# Altium schematic sheet Kasli-SOC_top.SchDoc: KASLI SOC v1.2.0
size 420 x 297 mm; Projet: FPGA & ARM SoC FMC Carrier; CheckedBy: G.Kasprowicz; Author: F.Switakowski; CompanyName: WUT ISE; DrawnBy: F.Switakowski; Organization: WUT ISE; Address1: PW ISE; Address2: Nowowiejska 15/19 00-665 Warsaw; Address3: gkasprow@gmail.com; DocumentNumber: 1; Revision: 1; SheetNumber: 1; SheetTotal: 18; ModifiedBy: -; CheckedDate: -; Title2: Top; DivGrp: WUT ISE; Designer: G.Kasprowicz; ModifiedDate: -; ProjectName: Sensor Box
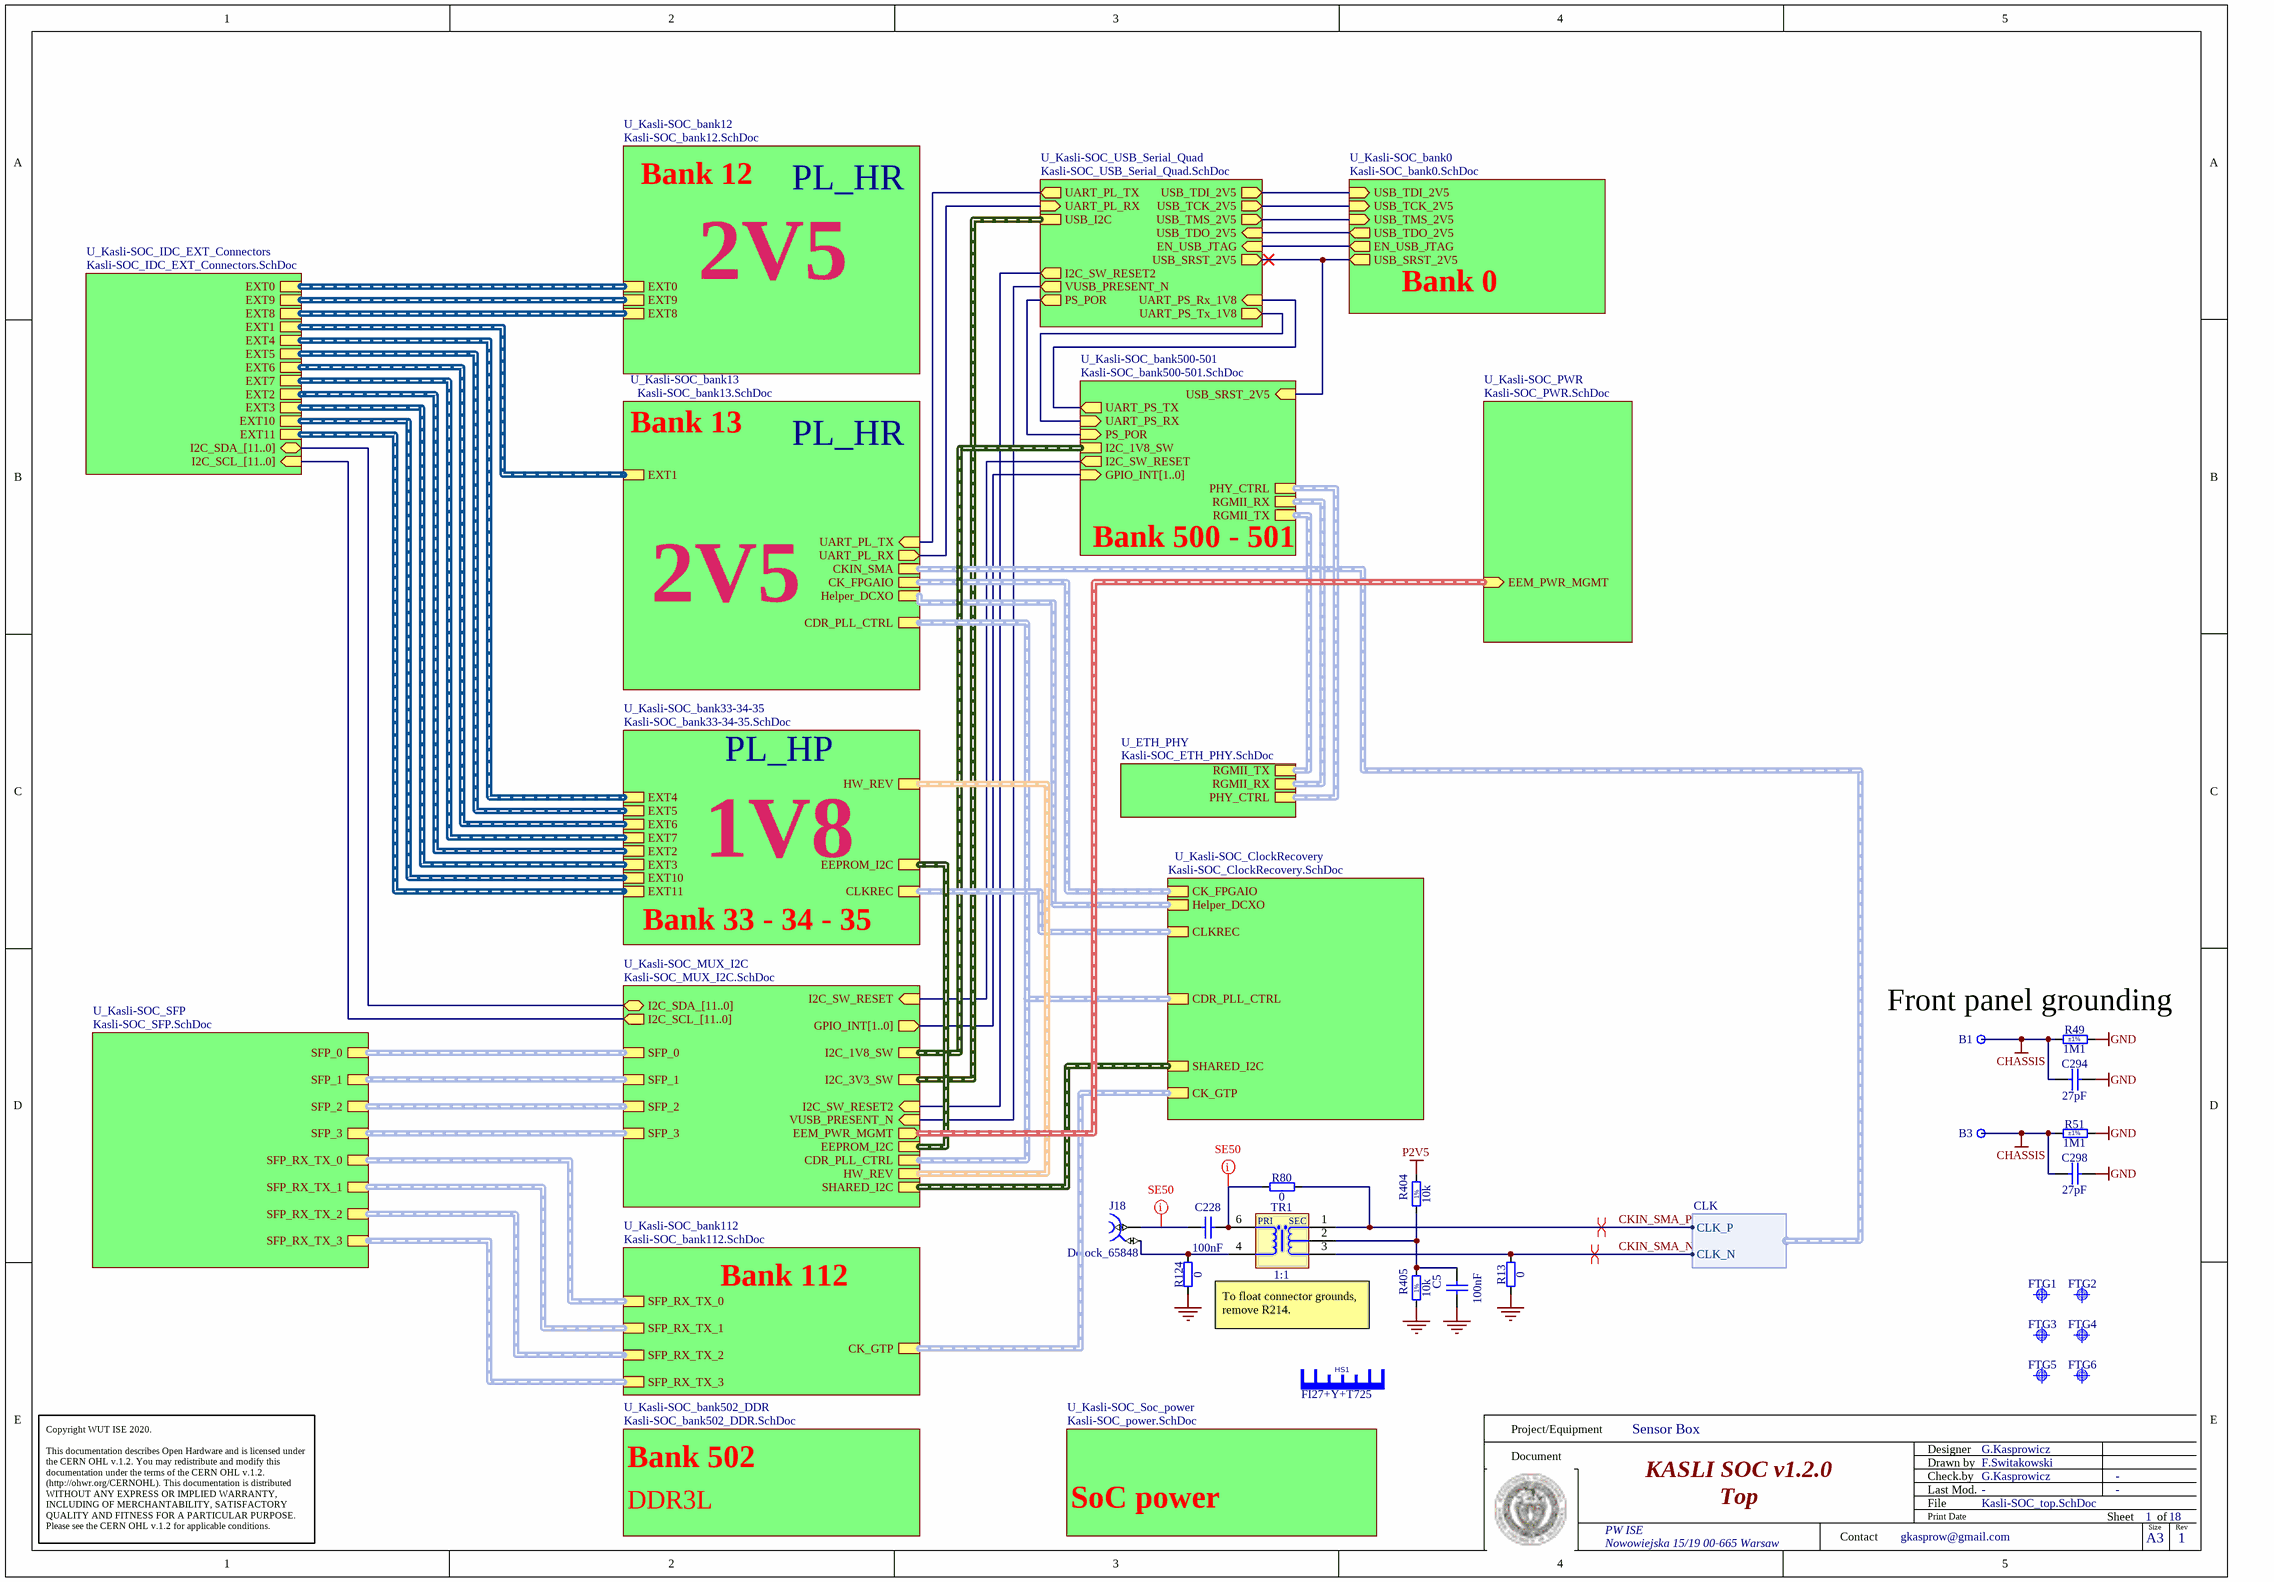
[diagram p0: Kasli-SOC_top.SchDoc]

## Parts
B1  Plated Hole  [MTG270_500]  (value not drawn)  (no BOM)
B3  Plated Hole  [MTG270_500]  (value not drawn)  (no BOM)
C5  100nF  [CAPC0603X33N]
C228  100nF  [CAPC0603X33N]
C294  27pF  [CAPC2012X135N]
C298  27pF  [CAPC2012X135N]
FTG1  Use only in PCB  [FIDUCIAL_TOP_S100-200]  (value not drawn)  (no BOM)
FTG2  Use only in PCB  [FIDUCIAL_TOP_S100-200]  (value not drawn)  (no BOM)
FTG3  Use only in PCB  [FIDUCIAL_TOP_S100-200]  (value not drawn)  (no BOM)
FTG4  Use only in PCB  [FIDUCIAL_TOP_S100-200]  (value not drawn)  (no BOM)
FTG5  Use only in PCB  [FIDUCIAL_TOP_S100-200]  (value not drawn)  (no BOM)
FTG6  Use only in PCB  [FIDUCIAL_TOP_S100-200]  (value not drawn)  (no BOM)
HS1  Manufacturer Part Number: FI27+Y+T725  (hidden comment: RADIAN_FI27+Y+T725)  (mechanical)
J18  Delock_65848  [Delock_65848]
R13  0  [RESC1005X40N]
R49  1M1  Tolerance: ±1%  [RESC1608X55N]
R51  1M1  Tolerance: ±1%  [RESC1608X55N]
R80  0  [RESC1005X40N]
R124  0  [RESC1005X40N]
R404  10k  [RESC1005X40N]
R405  10k  [RESC1005X40N]
TR1  1:1  [XFMR_MINI-CIRCUITS_AT1521]

## Sub-sheets
U_ETH_PHY = Kasli-SOC_ETH_PHY.SchDoc: RGMII_TX (harness RGMII), RGMII_RX (harness RGMII), PHY_CTRL (harness PHY_CTRL)
U_Kasli-SOC_bank0 = Kasli-SOC_bank0.SchDoc: USB_TDI_2V5 (in), USB_TCK_2V5 (in), USB_TMS_2V5 (in), USB_TDO_2V5 (out), EN_USB_JTAG (out), USB_SRST_2V5 (out)
U_Kasli-SOC_bank12 = Kasli-SOC_bank12.SchDoc: EXT0 (harness ExtensionConnector), EXT9 (harness ExtensionConnector), EXT8 (harness ExtensionConnector)
U_Kasli-SOC_bank13 = Kasli-SOC_bank13.SchDoc: CDR_PLL_CTRL (harness CDR_PLL_CTRL), EXT1 (harness ExtensionConnector), CK_FPGAIO (harness CLK), Helper_DCXO (harness CLK), CKIN_SMA (harness CLK), UART_PL_TX (in), UART_PL_RX (out)
U_Kasli-SOC_bank33-34-35 = Kasli-SOC_bank33-34-35.SchDoc: EXT6 (harness ExtensionConnector), EXT7 (harness ExtensionConnector), EXT2 (harness ExtensionConnector), EXT3 (harness ExtensionConnector), EXT10 (harness ExtensionConnector), EXT11 (harness ExtensionConnector), EXT5 (harness ExtensionConnector), EXT4 (harness ExtensionConnector), CLKREC (harness CLK), EEPROM_I2C (harness I2C), HW_REV (harness HW_REV)
U_Kasli-SOC_bank112 = Kasli-SOC_bank112.SchDoc: SFP_RX_TX_0 (harness SFP_RX_TX), SFP_RX_TX_1 (harness SFP_RX_TX), SFP_RX_TX_2 (harness SFP_RX_TX), SFP_RX_TX_3 (harness SFP_RX_TX), CK_GTP (harness CLK)
U_Kasli-SOC_bank500-501 = Kasli-SOC_bank500-501.SchDoc: UART_PS_RX (in), UART_PS_TX (out), PS_POR (in), USB_SRST_2V5 (in), GPIO_INT[1..0] (in), I2C_SW_RESET (out), I2C_1V8_SW (harness I2C), RGMII_RX (harness RGMII), RGMII_TX (harness RGMII), PHY_CTRL (harness PHY_CTRL)
U_Kasli-SOC_bank502_DDR = Kasli-SOC_bank502_DDR.SchDoc: no entries
U_Kasli-SOC_ClockRecovery = Kasli-SOC_ClockRecovery.SchDoc: CDR_PLL_CTRL (harness CDR_PLL_CTRL), SHARED_I2C (harness I2C), CK_GTP (harness CLK), CK_FPGAIO (harness CLK), Helper_DCXO (harness CLK), CLKREC (harness CLK)
U_Kasli-SOC_IDC_EXT_Connectors = Kasli-SOC_IDC_EXT_Connectors.SchDoc: EXT0 (harness ExtensionConnector), EXT4 (harness ExtensionConnector), EXT8 (harness ExtensionConnector), EXT9 (harness ExtensionConnector), EXT1 (harness ExtensionConnector), EXT7 (harness ExtensionConnector), EXT6 (harness ExtensionConnector), EXT5 (harness ExtensionConnector), EXT2 (harness ExtensionConnector), EXT3 (harness ExtensionConnector), EXT10 (harness ExtensionConnector), EXT11 (harness ExtensionConnector), I2C_SDA_[11..0] (bidir), I2C_SCL_[11..0] (in)
U_Kasli-SOC_MUX_I2C = Kasli-SOC_MUX_I2C.SchDoc: SFP_0 (harness SFP), SFP_1 (harness SFP), SFP_2 (harness SFP), SFP_3 (harness SFP), I2C_SW_RESET (in), I2C_SW_RESET2 (in), CDR_PLL_CTRL (harness CDR_PLL_CTRL), VUSB_PRESENT_N (in), GPIO_INT[1..0] (out), I2C_3V3_SW (harness I2C), I2C_1V8_SW (harness I2C), SHARED_I2C (harness I2C), I2C_SDA_[11..0] (bidir), I2C_SCL_[11..0] (out), EEPROM_I2C (harness I2C), HW_REV (harness HW_REV), EEM_PWR_MGMT (out)
U_Kasli-SOC_PWR = Kasli-SOC_PWR.SchDoc: EEM_PWR_MGMT (in)
U_Kasli-SOC_SFP = Kasli-SOC_SFP.SchDoc: SFP_RX_TX_0 (harness SFP_RX_TX), SFP_RX_TX_1 (harness SFP_RX_TX), SFP_RX_TX_2 (harness SFP_RX_TX), SFP_RX_TX_3 (harness SFP_RX_TX), SFP_0 (harness SFP), SFP_1 (harness SFP), SFP_2 (harness SFP), SFP_3 (harness SFP)
U_Kasli-SOC_Soc_power = Kasli-SOC_power.SchDoc: no entries
U_Kasli-SOC_USB_Serial_Quad = Kasli-SOC_USB_Serial_Quad.SchDoc: USB_TDI_2V5 (out), USB_TCK_2V5 (out), USB_TMS_2V5 (out), USB_TDO_2V5 (in), EN_USB_JTAG (in), I2C_SW_RESET2 (out), UART_PS_Rx_1V8 (in), UART_PS_Tx_1V8 (out), VUSB_PRESENT_N (out), USB_I2C (harness I2C), UART_PL_RX (in), UART_PL_TX (out), USB_SRST_2V5 (out), PS_POR (out)

## Harnesses
CLK: CLK_P, CLK_N

## Nets
CHASSIS: B1.1 B3.1 C294.1 C298.1 R49.1 R51.1
GND: C5.1 C294.2 C298.2 R13.1 R49.2 R51.2 R124.1 R405.1
P2V5: R404.2
CKIN_SMA_N: R13.2 TR1.3(S) ; sheet U_Kasli-SOC_bank13/CKIN_SMA.CLK_N
CKIN_SMA_P: R80.2 TR1.1(SDOT) ; sheet U_Kasli-SOC_bank13/CKIN_SMA.CLK_P
NetC5_2: C5.2 R404.1 R405.2 TR1.2(NC)
NetC228_1: C228.1 J18.1
NetC228_2: C228.2 R80.1 TR1.6(PDOT)
NetJ18_2: J18.2 R124.2 TR1.4(P)
(unnamed): sheet U_Kasli-SOC_bank500-501/UART_PS_RX, sheet U_Kasli-SOC_USB_Serial_Quad/UART_PS_Tx_1V8
(unnamed): sheet U_Kasli-SOC_bank500-501/UART_PS_TX, sheet U_Kasli-SOC_USB_Serial_Quad/UART_PS_Rx_1V8
(unnamed): sheet U_Kasli-SOC_bank500-501/PS_POR, sheet U_Kasli-SOC_USB_Serial_Quad/PS_POR
(unnamed): sheet U_Kasli-SOC_bank500-501/USB_SRST_2V5, sheet U_Kasli-SOC_USB_Serial_Quad/USB_SRST_2V5, sheet U_Kasli-SOC_bank0/USB_SRST_2V5
(unnamed): sheet U_Kasli-SOC_bank500-501/I2C_SW_RESET, sheet U_Kasli-SOC_MUX_I2C/I2C_SW_RESET
(unnamed): sheet U_Kasli-SOC_bank13/UART_PL_TX, sheet U_Kasli-SOC_USB_Serial_Quad/UART_PL_TX
(unnamed): sheet U_Kasli-SOC_bank13/UART_PL_RX, sheet U_Kasli-SOC_USB_Serial_Quad/UART_PL_RX
(unnamed): sheet U_Kasli-SOC_MUX_I2C/I2C_SW_RESET2, sheet U_Kasli-SOC_USB_Serial_Quad/I2C_SW_RESET2
(unnamed): sheet U_Kasli-SOC_MUX_I2C/VUSB_PRESENT_N, sheet U_Kasli-SOC_USB_Serial_Quad/VUSB_PRESENT_N
(unnamed): sheet U_Kasli-SOC_USB_Serial_Quad/USB_TDI_2V5, sheet U_Kasli-SOC_bank0/USB_TDI_2V5
(unnamed): sheet U_Kasli-SOC_USB_Serial_Quad/USB_TCK_2V5, sheet U_Kasli-SOC_bank0/USB_TCK_2V5
(unnamed): sheet U_Kasli-SOC_USB_Serial_Quad/USB_TMS_2V5, sheet U_Kasli-SOC_bank0/USB_TMS_2V5
(unnamed): sheet U_Kasli-SOC_USB_Serial_Quad/USB_TDO_2V5, sheet U_Kasli-SOC_bank0/USB_TDO_2V5
(unnamed): sheet U_Kasli-SOC_USB_Serial_Quad/EN_USB_JTAG, sheet U_Kasli-SOC_bank0/EN_USB_JTAG

## Buses and harness runs
bus sheet U_Kasli-SOC_bank500-501/GPIO_INT[1..0] = sheet U_Kasli-SOC_MUX_I2C/GPIO_INT[1..0]
bus sheet U_Kasli-SOC_IDC_EXT_Connectors/I2C_SCL_[11..0] = sheet U_Kasli-SOC_MUX_I2C/I2C_SCL_[11..0]
bus sheet U_Kasli-SOC_IDC_EXT_Connectors/I2C_SDA_[11..0] = sheet U_Kasli-SOC_MUX_I2C/I2C_SDA_[11..0]
harness sheet U_ETH_PHY/PHY_CTRL = sheet U_Kasli-SOC_bank500-501/PHY_CTRL
harness sheet U_ETH_PHY/RGMII_RX = sheet U_Kasli-SOC_bank500-501/RGMII_RX
harness sheet U_ETH_PHY/RGMII_TX = sheet U_Kasli-SOC_bank500-501/RGMII_TX
harness sheet U_Kasli-SOC_bank12/EXT0 = sheet U_Kasli-SOC_IDC_EXT_Connectors/EXT0
harness sheet U_Kasli-SOC_bank12/EXT8 = sheet U_Kasli-SOC_IDC_EXT_Connectors/EXT8
harness sheet U_Kasli-SOC_bank12/EXT9 = sheet U_Kasli-SOC_IDC_EXT_Connectors/EXT9
harness sheet U_Kasli-SOC_bank13/CDR_PLL_CTRL = sheet U_Kasli-SOC_ClockRecovery/CDR_PLL_CTRL = sheet U_Kasli-SOC_MUX_I2C/CDR_PLL_CTRL
harness sheet U_Kasli-SOC_bank13/CK_FPGAIO = sheet U_Kasli-SOC_ClockRecovery/CK_FPGAIO
harness sheet U_Kasli-SOC_bank13/EXT1 = sheet U_Kasli-SOC_IDC_EXT_Connectors/EXT1
harness sheet U_Kasli-SOC_bank13/Helper_DCXO = sheet U_Kasli-SOC_ClockRecovery/Helper_DCXO
harness sheet U_Kasli-SOC_bank33-34-35/CLKREC = sheet U_Kasli-SOC_ClockRecovery/CLKREC
harness sheet U_Kasli-SOC_bank33-34-35/EEPROM_I2C = sheet U_Kasli-SOC_MUX_I2C/EEPROM_I2C
harness sheet U_Kasli-SOC_bank33-34-35/EXT2 = sheet U_Kasli-SOC_IDC_EXT_Connectors/EXT2
harness sheet U_Kasli-SOC_bank33-34-35/EXT3 = sheet U_Kasli-SOC_IDC_EXT_Connectors/EXT3
harness sheet U_Kasli-SOC_bank33-34-35/EXT4 = sheet U_Kasli-SOC_IDC_EXT_Connectors/EXT4
harness sheet U_Kasli-SOC_bank33-34-35/EXT5 = sheet U_Kasli-SOC_IDC_EXT_Connectors/EXT5
harness sheet U_Kasli-SOC_bank33-34-35/EXT6 = sheet U_Kasli-SOC_IDC_EXT_Connectors/EXT6
harness sheet U_Kasli-SOC_bank33-34-35/EXT7 = sheet U_Kasli-SOC_IDC_EXT_Connectors/EXT7
harness sheet U_Kasli-SOC_bank33-34-35/EXT10 = sheet U_Kasli-SOC_IDC_EXT_Connectors/EXT10
harness sheet U_Kasli-SOC_bank33-34-35/EXT11 = sheet U_Kasli-SOC_IDC_EXT_Connectors/EXT11
harness sheet U_Kasli-SOC_bank33-34-35/HW_REV = sheet U_Kasli-SOC_MUX_I2C/HW_REV
harness sheet U_Kasli-SOC_bank112/CK_GTP = sheet U_Kasli-SOC_ClockRecovery/CK_GTP
harness sheet U_Kasli-SOC_bank112/SFP_RX_TX_0 = sheet U_Kasli-SOC_SFP/SFP_RX_TX_0
harness sheet U_Kasli-SOC_bank112/SFP_RX_TX_1 = sheet U_Kasli-SOC_SFP/SFP_RX_TX_1
harness sheet U_Kasli-SOC_bank112/SFP_RX_TX_2 = sheet U_Kasli-SOC_SFP/SFP_RX_TX_2
harness sheet U_Kasli-SOC_bank112/SFP_RX_TX_3 = sheet U_Kasli-SOC_SFP/SFP_RX_TX_3
harness sheet U_Kasli-SOC_bank500-501/I2C_1V8_SW = sheet U_Kasli-SOC_MUX_I2C/I2C_1V8_SW
harness sheet U_Kasli-SOC_ClockRecovery/SHARED_I2C = sheet U_Kasli-SOC_MUX_I2C/SHARED_I2C
harness sheet U_Kasli-SOC_MUX_I2C/EEM_PWR_MGMT = sheet U_Kasli-SOC_PWR/EEM_PWR_MGMT
harness sheet U_Kasli-SOC_MUX_I2C/I2C_3V3_SW = sheet U_Kasli-SOC_USB_Serial_Quad/USB_I2C
harness sheet U_Kasli-SOC_MUX_I2C/SFP_0 = sheet U_Kasli-SOC_SFP/SFP_0
harness sheet U_Kasli-SOC_MUX_I2C/SFP_1 = sheet U_Kasli-SOC_SFP/SFP_1
harness sheet U_Kasli-SOC_MUX_I2C/SFP_2 = sheet U_Kasli-SOC_SFP/SFP_2
harness sheet U_Kasli-SOC_MUX_I2C/SFP_3 = sheet U_Kasli-SOC_SFP/SFP_3

## Layout directives
net class SE50: NetC228_1, NetC228_2
differential pair; differential pair class Diff_100Ohm: CKIN_SMA_N, CKIN_SMA_P

## Notes on the sheet
- Bank 12
- PL_HR
- 2V5
- Bank 0
- Bank 13
- Bank 500 - 501
- PL_HP
- 1V8
- Bank 33 - 34 - 35
- Front panel grounding
- Bank 112
- To float connector grounds, remove R214.
- Bank 502
- DDR3L
- SoC power
- Project/Equipment
- Document
- Designer
- Drawn by
- Check.by
- Copyright WUT ISE 2020.
  This documentation describes Open Hardware and is licensed under the CERN OHL v.1.2. You may redistribute and modify this documentation under the terms of the CERN OHL v.1.2. (http://ohwr.org/CERNOHL). This documentation is distributed WITHOUT ANY EXPRESS OR IMPLIED WARRANTY, INCLUDING OF MERCHANTABILITY, SATISFACTORY QUALITY AND FITNESS FOR A PARTICULAR PURPOSE. Please see the CERN OHL v.1.2 for applicable conditions.
- Contact
- File
- Last Mod.
- Print Date
- Sheet
- Size
- A3
- of
- Rev
- (in symbol R0402_10K_1%_0.0625W_100PPM) 1%
- (in symbol XFMR_MINI-CIRCUITS_TC2-1TX+) PRI; SEC

## Library data of the parts
B1 B3 = PLATED_HOLE2.7_PAD5.0: Single Terminal Socket; Part Description: Plated Through Hole: Hole Dia.=2.7mm Pad Dia.=5.0mm; Mounted: No; Part Number: PLATED_HOLE2.7_PAD5.0; Component Type: Standard (No BOM); Pin Count: 1; Family: Plated Hole; Socket: No; SMD: No; Sense: No; Status: None; ComponentHeight: 0mm; HelpURL: Undefined; Author: CERN DEM JMW; CreateDate: 27.09.2011; LatestRevisionDate: 27.09.2011; PackageDescription: Plated Through Hole: Hole Dia.=2.7mm Pad Dia.=5.0mm
C5 C228 = CC0201_100NF_6.3V_10%_X5R: Non-polarised capacitor; Part Description: SMD Multilayer Chip Ceramic Capacitor; Manufacturer: GENERIC; Manufacturer1 Part Number: 02016D104KAT2A; Voltage: 6.3V; TC: X5R; Tolerance: ±10%; Part Number: CC0201_100NF_6.3V_10%_X5R; Component Kind: Standard; Component Type: Standard; Pin Count: 2; Value: 100nF; Status: Not Recommended; Manufacturer Part Number: CC0201_100NF_6.3V_10%_X5R; Case: 0201; Mounted: Yes; Socket: No; SMD: Yes; Sense: No; Manufacturer1 Example: AVX; Manufacturer1 ComponentHeight: 0.33mm; HelpURL: \\cern.ch\dfs\Applications\Altium\Datasheets\CC0201_X5R_AVX.pdf; Author: CERN DEM JLC; CreateDate: 2007-12-03; LatestRevisionDate: 2007-12-03
C294 C298 = CC0805_27PF_50V_5%_NP0: Non-polarised capacitor; Part Description: SMD Multilayer Chip Ceramic Capacitor; Manufacturer: GENERIC; Manufacturer1 Part Number: 223886115279; Voltage: 50V; TC: C0G/NP0; Tolerance: ±5%; Part Number: CC0805_27PF_50V_5%_NP0; Component Kind: Standard; Component Type: Standard; Pin Count: 2; Value: 27pF; Status: Preferred; Manufacturer Part Number: CC0805_27PF_50V_5%_NP0; Case: 0805; Mounted: Yes; Socket: No; SMD: Yes; Sense: No; Manufacturer1 Example: PHYCOMP; Manufacturer1 ComponentHeight: 1.35mm; HelpURL: \\cern.ch\dfs\Applications\Altium\Datasheets\CC0805_NP0_PHYCOMP.pdf; Author: CERN DEM JLC; CreateDate: 12/3/2007; LatestRevisionDate: 12/3/2007
FTG1-FTG6 = FIDUCIAL_TARGET_S100-200: Fiducial Target; Part Description: Square Fiducial Target, Top Layer, 1.0mm, Top Solder 2.0mm, Keepout =2.0mm; Mounted: No; Part Number: FIDUCIAL_TARGET_S100-200; Component Type: Standard (No BOM); Pin Count: 1; Family: Fiducial; Socket: No; SMD: Yes; Sense: No; Status: None; ComponentHeight: 0mm; HelpURL: Undefined; Author: CERN DEM JLC; CreateDate: 09.02.2010; LatestRevisionDate: 04.04.2012; PackageDescription: Square Fiducial Target, Top Layer, 1.0mm, Top Solder 2.0mm, Keepout =2.0mm
HS1 = RADIAN_FI23: Heat Sink Without Pad; Manufacturer: Radian Thermal Products, Inc.; Part Description: 27 x 27 x 16 mm, clip on heatsink with fan for IC design BGA and others; ComponentHeight: 16 mm; HelpURL: https://www.radianheatsinks.com/product/fi23/
J18 = CMP-002-04652-1: SMA connector Delock 65848
R13 R80 R124 = R0402_0R_JUMPER: Resistor; Part Description: 1A (0.05R Max DC Resistance) Zero Ohm Jumper; Manufacturer: GENERIC; Manufacturer1 Part Number: 232270591001L; PressFit: No; Part Number: R0402_0R_JUMPER; Component Kind: Standard; Component Type: Standard; Pin Count: 2; Value: 0; Status: Not Recommended; Manufacturer Part Number: R0402_0R_JUMPER; Case: 0402; Mounted: Yes; Sense: No; Socket: No; SMD: Yes; Manufacturer1 Example: YAGEO PHYCOMP; Manufacturer1 ComponentHeight: 0.4mm; HelpURL: \\cern.ch\dfs\Applications\Altium\Datasheets\R0402_Phycomp_RC0402.pdf; Author: CERN DEM JLC; CreateDate: 03.12.2007; LatestRevisionDate: 17.10.2012
R49 R51 = R0603_1M1_1%_0.1W_100PPM: Resistor - 1%; Part Description: General Purpose Thick Film Chip Resistor; Manufacturer: GENERIC; Manufacturer1 Part Number: NRC06F1104TRF; Power: 0.1W; TC: ±100ppm/°C; PressFit: No; Part Number: R0603_1M1_1%_0.1W_100PPM; Component Kind: Standard; Component Type: Standard; Pin Count: 2; Value: 1M1; Status: Preferred; Manufacturer Part Number: R0603_1M1_1%_0.1W_100PPM; Case: 0603; Mounted: Yes; Sense: No; Socket: No; SMD: Yes; Manufacturer1 Example: NIC COMPONENT; Manufacturer1 ComponentHeight: 0.55mm; HelpURL: \\cern.ch\dfs\Applications\Altium\Datasheets\R0603_NIC_NRC.pdf; Author: CERN DEM JLC; CreateDate: 12/3/2007; LatestRevisionDate: 3/13/2008
R404 R405 = R0402_10K_1%_0.0625W_100PPM: Resistor - 1%; Part Description: General Purpose Thick Film Chip Resistor; Manufacturer: GENERIC; Manufacturer1 Part Number: 232270671003L; TC: ±100ppm/°C; PressFit: No; Part Number: R0402_10K_1%_0.0625W_100PPM; Component Kind: Standard; Component Type: Standard; Pin Count: 2; Value: 10k; Status: Not Recommended; Power: 0.0625W; Tolerance: ±1%; Manufacturer Part Number: R0402_10K_1%_0.0625W_100PPM; Case: 0402; Mounted: Yes; Sense: No; Socket: No; SMD: Yes; Manufacturer1 Example: YAGEO PHYCOMP; Manufacturer1 ComponentHeight: 0.4mm; HelpURL: \\cern.ch\dfs\Applications\Altium\Datasheets\R0402_Phycomp_RC0402.pdf; Author: CERN DEM JLC; CreateDate: 03.12.2007; LatestRevisionDate: 17.10.2012
TR1 = XFMR_MINI-CIRCUITS_TC2-1TX+: 50 Ohms 3 to 300MHz RF Transformer; Part Number: XFMR_MINI-CIRCUITS_TC2-1TX+; Component Kind: Standard; Component Type: Standard; Pin Count: 5; Value: 1:1; Status: None; Part Description: 50 Ohms 3 to 300MHz RF Transformer; Manufacturer: MINI-CIRCUITS; Manufacturer Part Number: TC2-1TX+; Mounted: Yes; Socket: No; Sense: No; SMD: Yes; ComponentHeight: 4.06mm; HelpURL: \\cern.ch\dfs\Applications\Altium\Datasheets\XFMR_MINI-CIRCUITS_TC2-1TX+.pdf; Author: CERN DEM MR; CreateDate: 18.10.2019; LatestRevisionDate: 18.10.2019